# EAGLE schematic PediPeriMeridian (EAGLE 7.1.0)
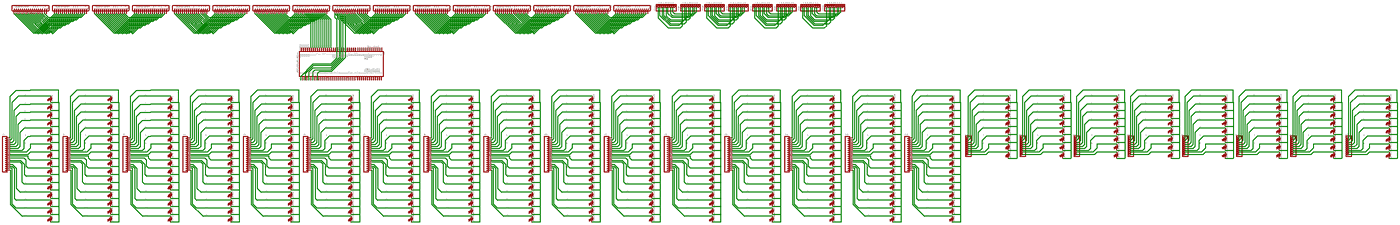
[diagram p0: schematic, sheet 1, overview]
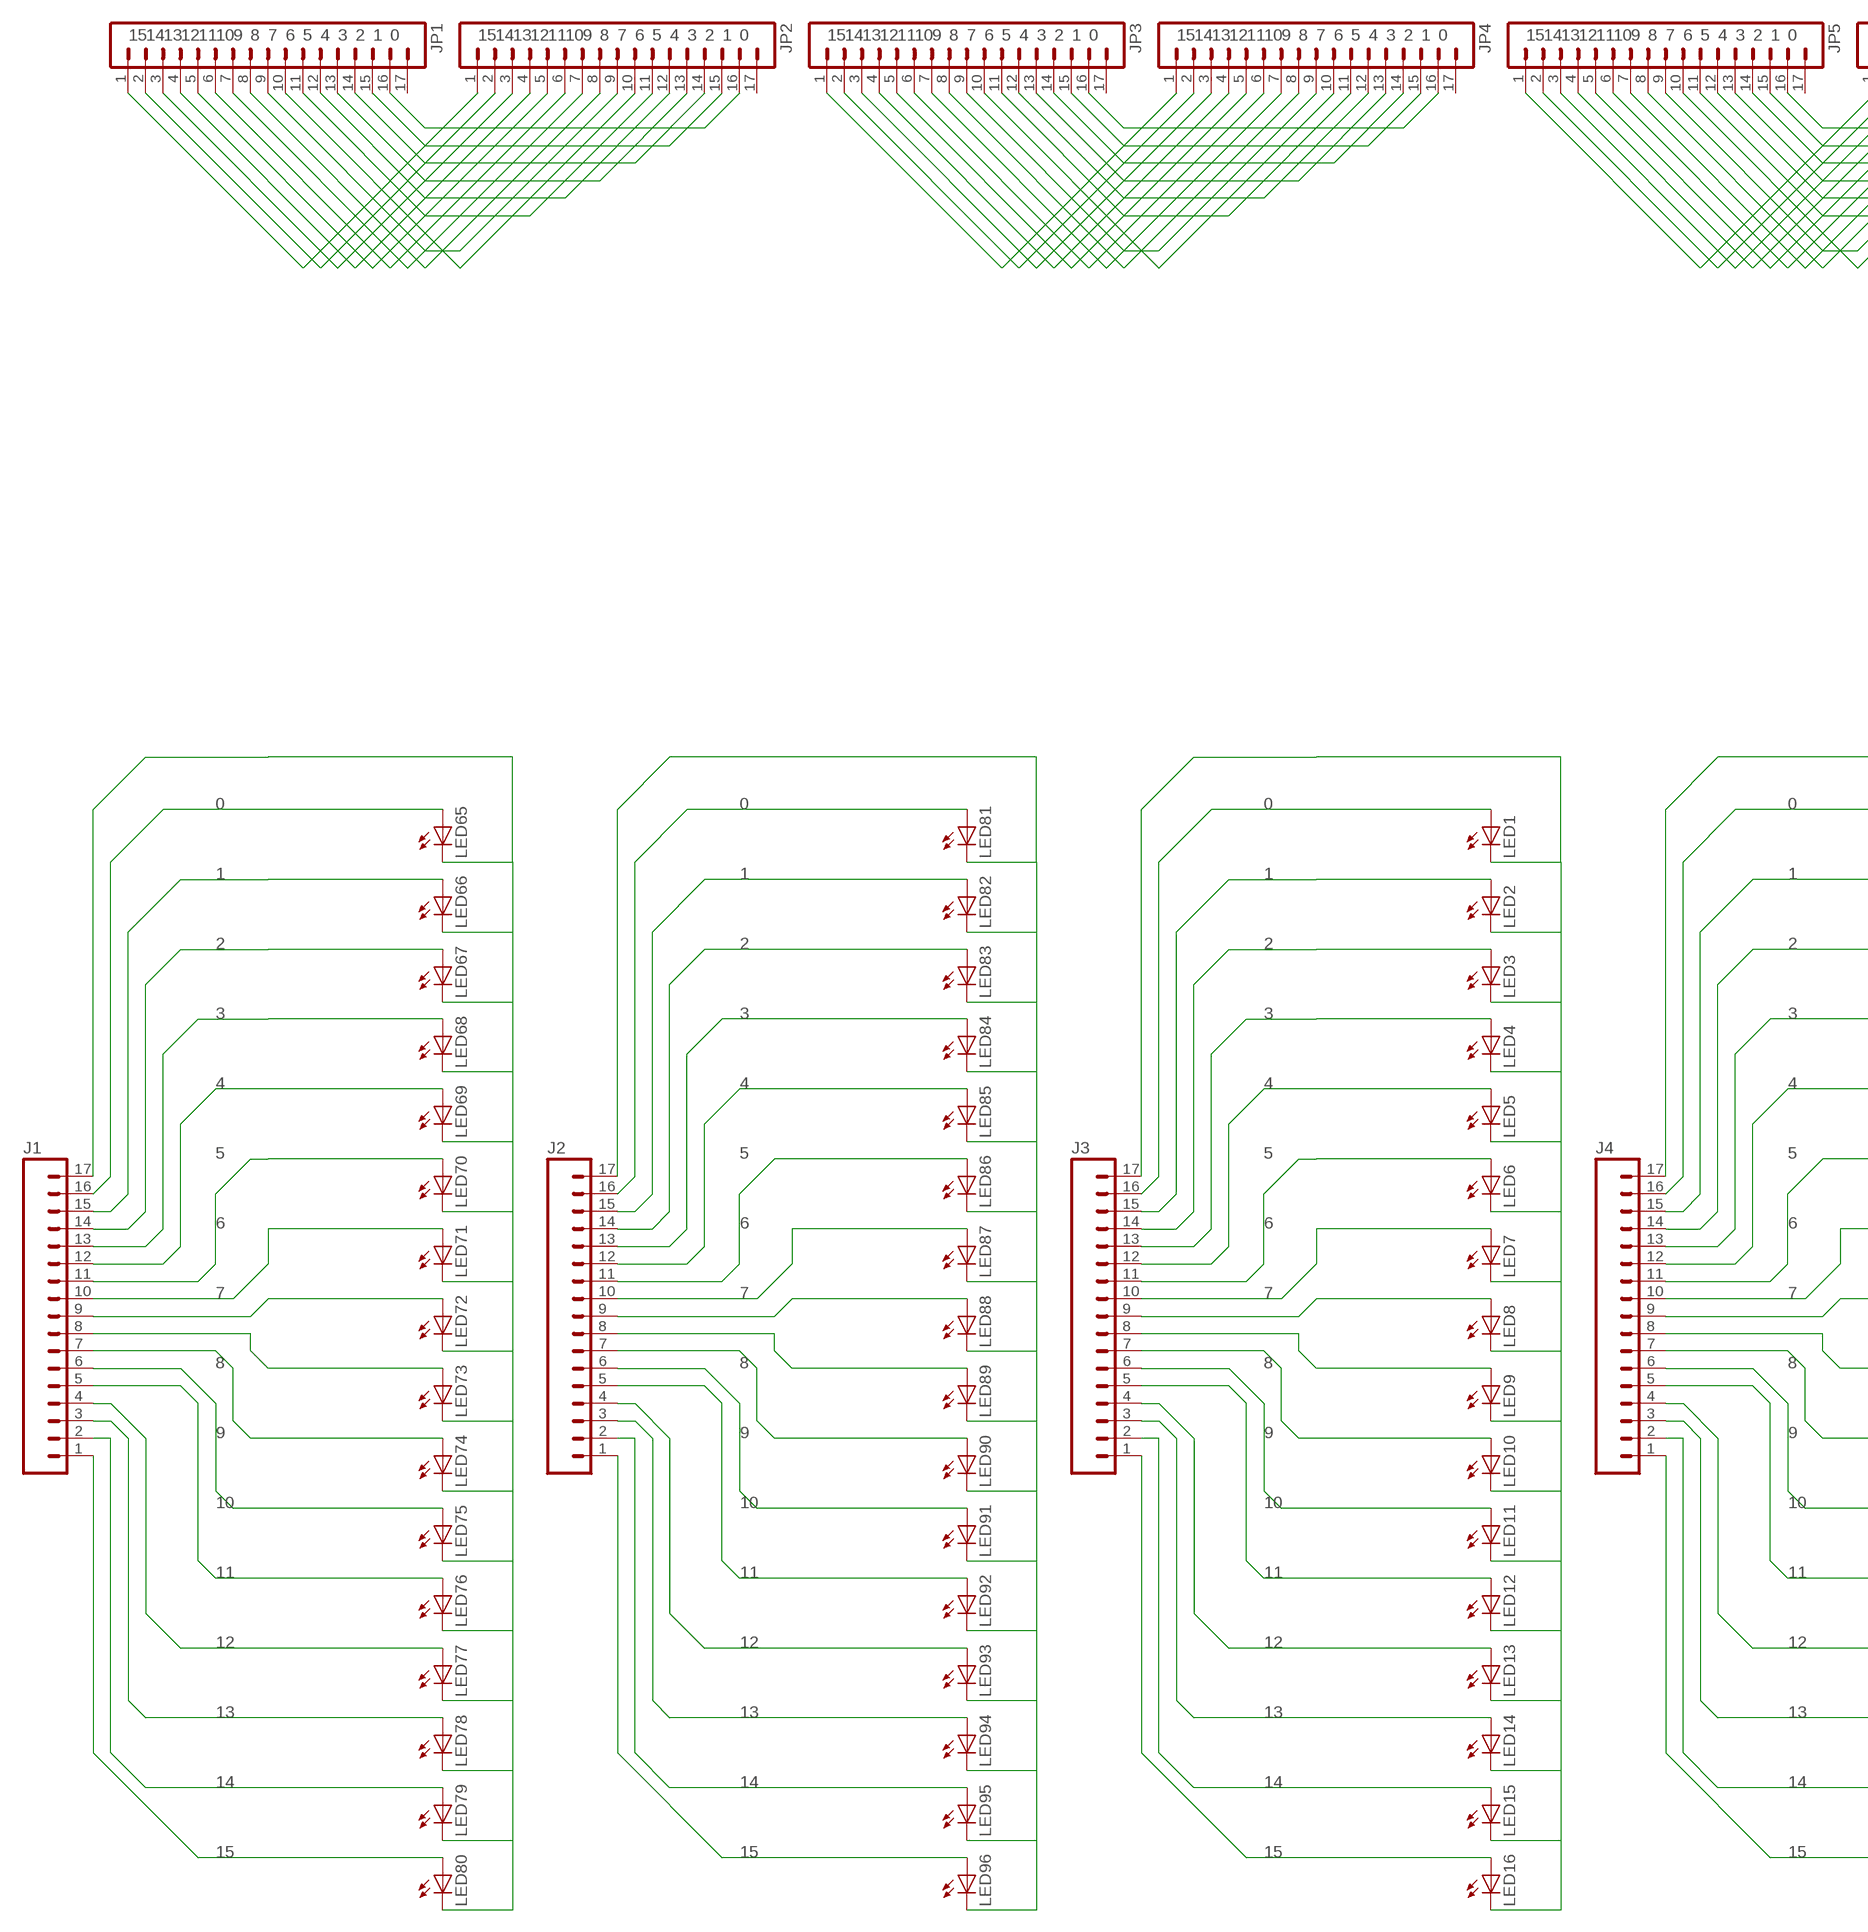
[diagram p1: schematic, sheet 1, part 1 of 5]
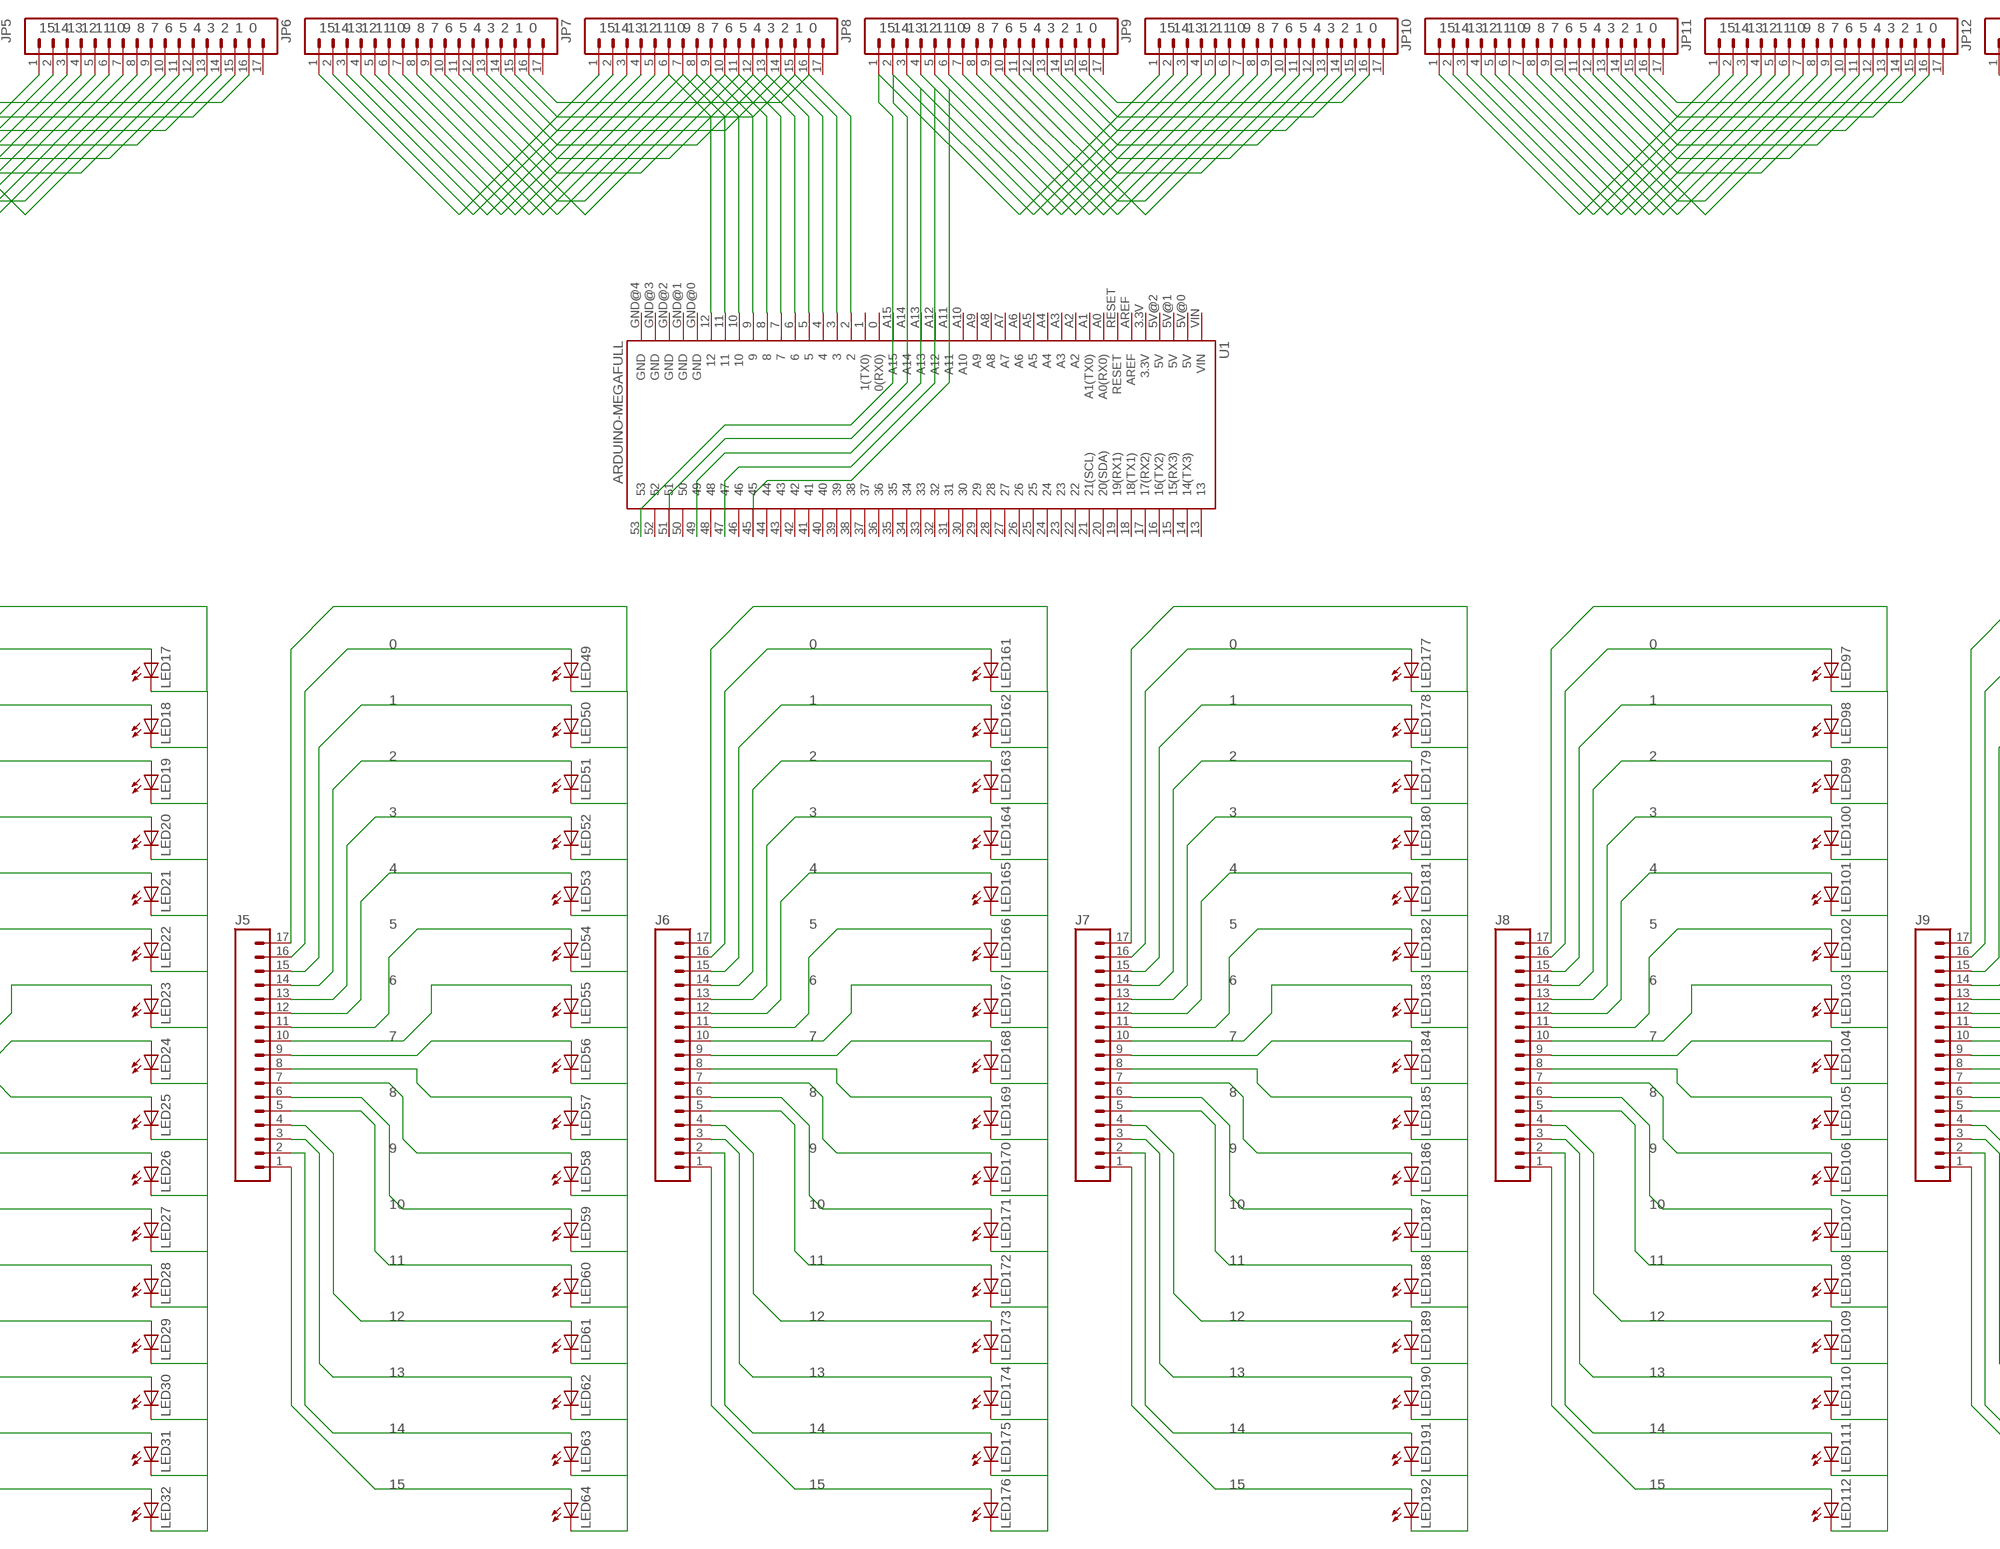
[diagram p2: schematic, sheet 1, part 2 of 5]
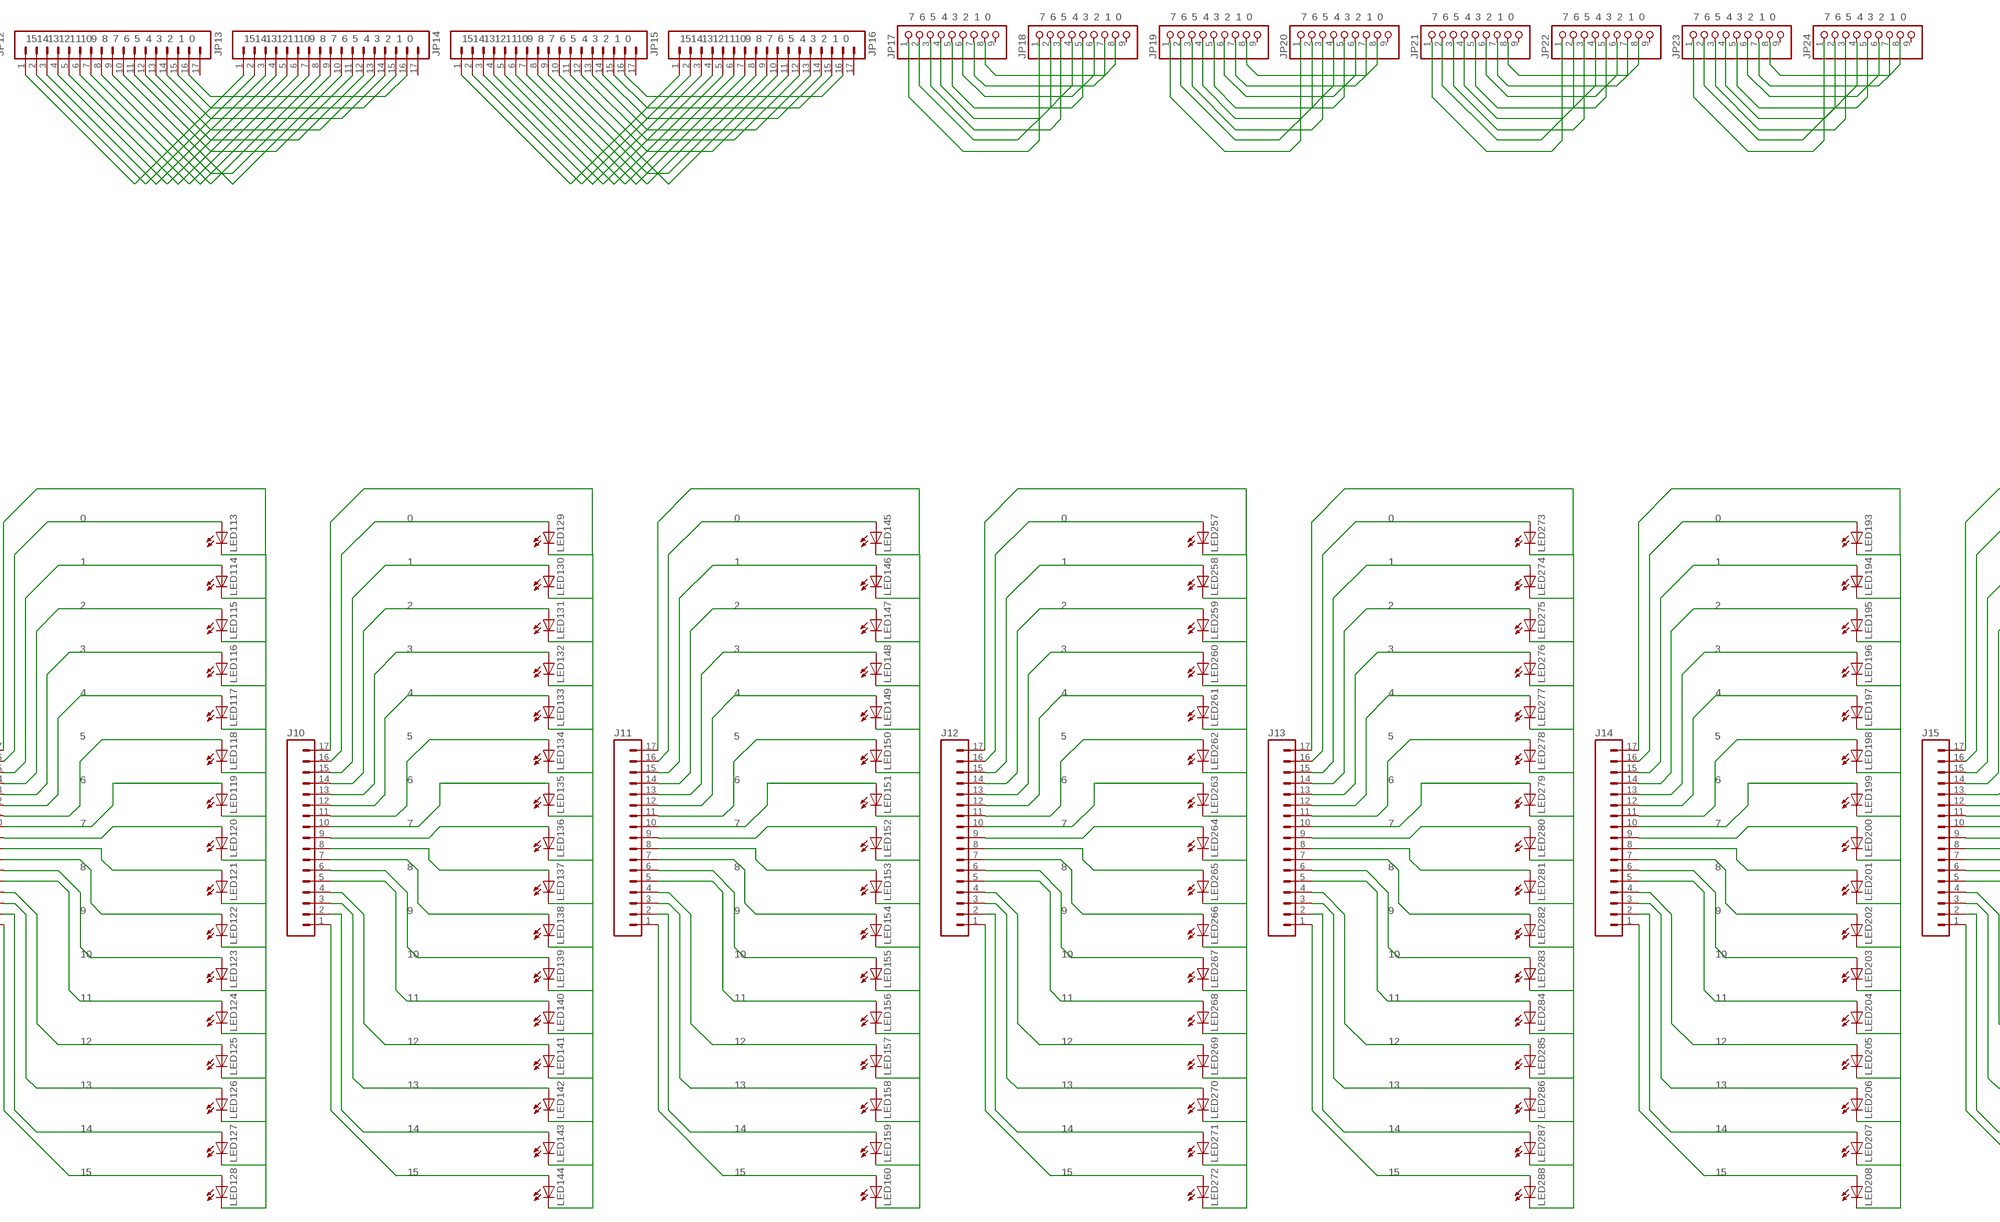
[diagram p3: schematic, sheet 1, part 3 of 5]
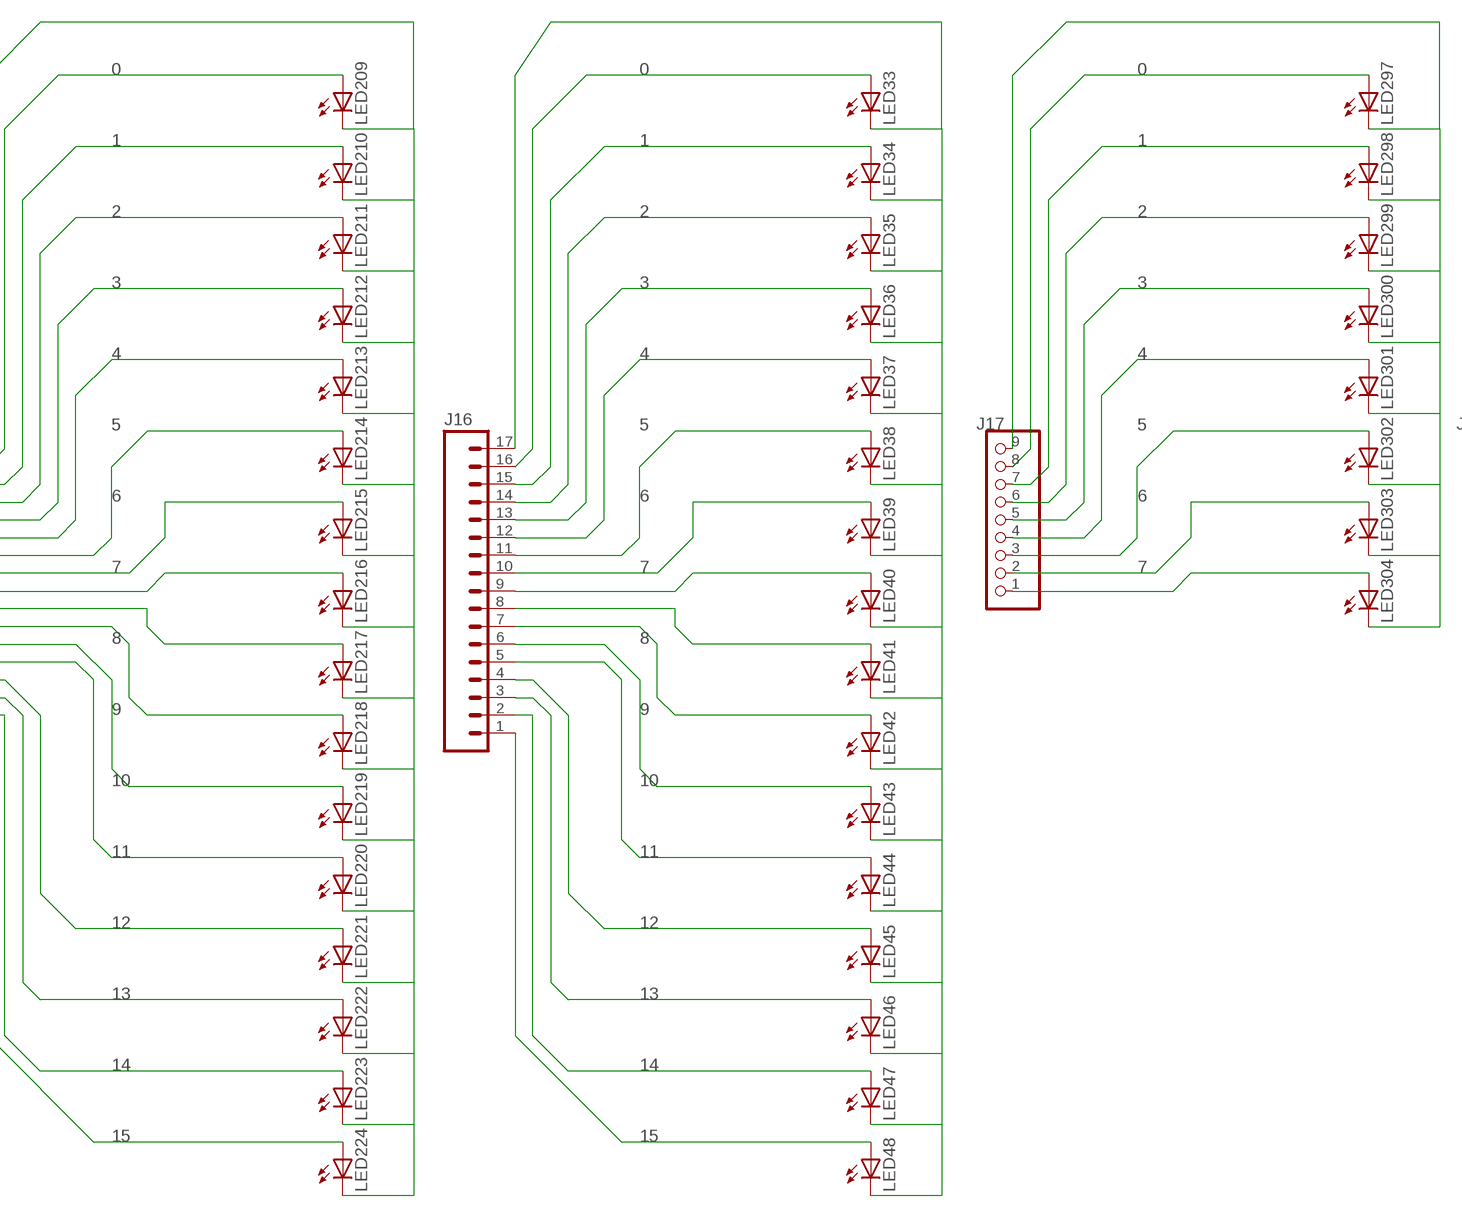
[diagram p4: schematic, sheet 1, part 4 of 5]
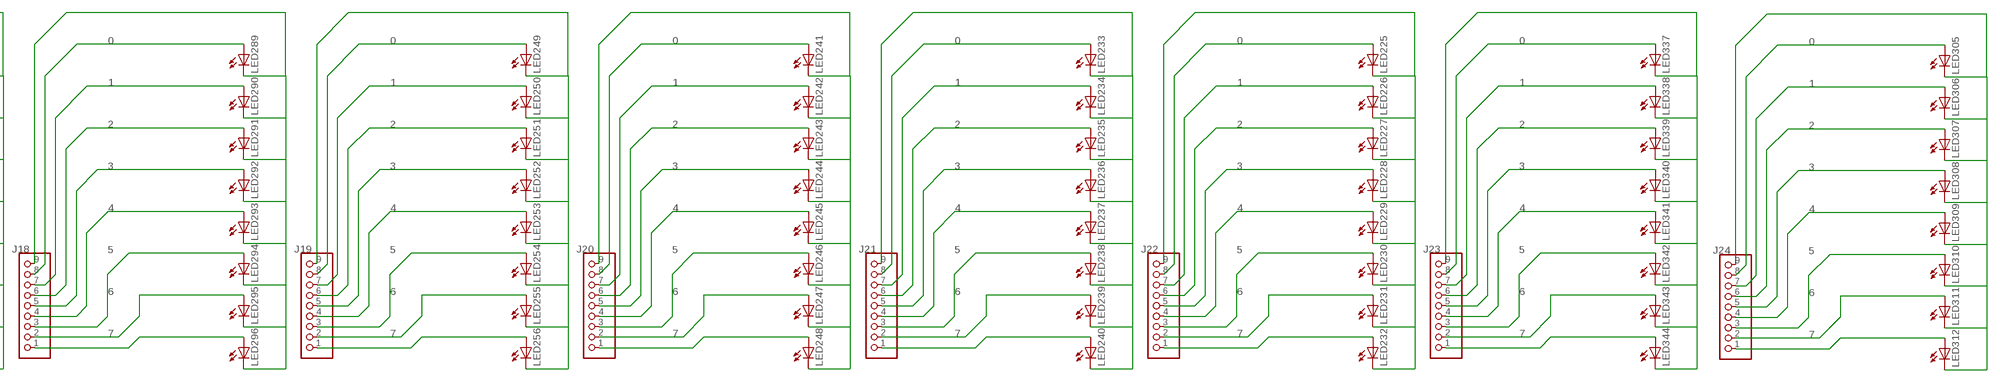
[diagram p5: schematic, sheet 1, part 5 of 5]

## Parts
J1  M17  [1X17]
J2  M17  [1X17]
J3  M17  [1X17]
J4  M17  [1X17]
J5  M17  [1X17]
J6  M17  [1X17]
J7  M17  [1X17]
J8  M17  [1X17]
J9  M17  [1X17]
J10  M17  [1X17]
J11  M17  [1X17]
J12  M17  [1X17]
J13  M17  [1X17]
J14  M17  [1X17]
J15  M17  [1X17]
J16  M17  [1X17]
J17  PINHD-1X9  [1X09-BIG]
J18  PINHD-1X9  [1X09-BIG]
J19  PINHD-1X9  [1X09-BIG]
J20  PINHD-1X9  [1X09-BIG]
J21  PINHD-1X9  [1X09-BIG]
J22  PINHD-1X9  [1X09-BIG]
J23  PINHD-1X9  [1X09-BIG]
J24  PINHD-1X9  [1X09-BIG]
JP1  M17  [1X17]
JP2  M17  [1X17]
JP3  M17  [1X17]
JP4  M17  [1X17]
JP5  M17  [1X17]
JP6  M17  [1X17]
JP7  M17  [1X17]
JP8  M17  [1X17]
JP9  M17  [1X17]
JP10  M17  [1X17]
JP11  M17  [1X17]
JP12  M17  [1X17]
JP13  M17  [1X17]
JP14  M17  [1X17]
JP15  M17  [1X17]
JP16  M17  [1X17]
JP17  PINHD-1X9  [1X09-BIG]
JP18  PINHD-1X9  [1X09-BIG]
JP19  PINHD-1X9  [1X09-BIG]
JP20  PINHD-1X9  [1X09-BIG]
JP21  PINHD-1X9  [1X09-BIG]
JP22  PINHD-1X9  [1X09-BIG]
JP23  PINHD-1X9  [1X09-BIG]
JP24  PINHD-1X9  [1X09-BIG]
LED1  LED5MM  [LED5MM]
LED2  LED5MM  [LED5MM]
LED3  LED5MM  [LED5MM]
LED4  LED5MM  [LED5MM]
LED5  LED5MM  [LED5MM]
LED6  LED5MM  [LED5MM]
LED7  LED5MM  [LED5MM]
LED8  LED5MM  [LED5MM]
LED9  LED5MM  [LED5MM]
LED10  LED5MM  [LED5MM]
LED11  LED5MM  [LED5MM]
LED12  LED5MM  [LED5MM]
LED13  LED5MM  [LED5MM]
LED14  LED5MM  [LED5MM]
LED15  LED5MM  [LED5MM]
LED16  LED5MM  [LED5MM]
LED17  LED5MM  [LED5MM]
LED18  LED5MM  [LED5MM]
LED19  LED5MM  [LED5MM]
LED20  LED5MM  [LED5MM]
LED21  LED5MM  [LED5MM]
LED22  LED5MM  [LED5MM]
LED23  LED5MM  [LED5MM]
LED24  LED5MM  [LED5MM]
LED25  LED5MM  [LED5MM]
LED26  LED5MM  [LED5MM]
LED27  LED5MM  [LED5MM]
LED28  LED5MM  [LED5MM]
LED29  LED5MM  [LED5MM]
LED30  LED5MM  [LED5MM]
LED31  LED5MM  [LED5MM]
LED32  LED5MM  [LED5MM]
LED33  LED5MM  [LED5MM]
LED34  LED5MM  [LED5MM]
LED35  LED5MM  [LED5MM]
LED36  LED5MM  [LED5MM]
LED37  LED5MM  [LED5MM]
LED38  LED5MM  [LED5MM]
LED39  LED5MM  [LED5MM]
LED40  LED5MM  [LED5MM]
LED41  LED5MM  [LED5MM]
LED42  LED5MM  [LED5MM]
LED43  LED5MM  [LED5MM]
LED44  LED5MM  [LED5MM]
LED45  LED5MM  [LED5MM]
LED46  LED5MM  [LED5MM]
LED47  LED5MM  [LED5MM]
LED48  LED5MM  [LED5MM]
LED49  LED5MM  [LED5MM]
LED50  LED5MM  [LED5MM]
LED51  LED5MM  [LED5MM]
LED52  LED5MM  [LED5MM]
LED53  LED5MM  [LED5MM]
LED54  LED5MM  [LED5MM]
LED55  LED5MM  [LED5MM]
LED56  LED5MM  [LED5MM]
LED57  LED5MM  [LED5MM]
LED58  LED5MM  [LED5MM]
LED59  LED5MM  [LED5MM]
LED60  LED5MM  [LED5MM]
LED61  LED5MM  [LED5MM]
LED62  LED5MM  [LED5MM]
LED63  LED5MM  [LED5MM]
LED64  LED5MM  [LED5MM]
LED65  LED5MM  [LED5MM]
LED66  LED5MM  [LED5MM]
LED67  LED5MM  [LED5MM]
LED68  LED5MM  [LED5MM]
LED69  LED5MM  [LED5MM]
LED70  LED5MM  [LED5MM]
LED71  LED5MM  [LED5MM]
LED72  LED5MM  [LED5MM]
LED73  LED5MM  [LED5MM]
LED74  LED5MM  [LED5MM]
LED75  LED5MM  [LED5MM]
LED76  LED5MM  [LED5MM]
LED77  LED5MM  [LED5MM]
LED78  LED5MM  [LED5MM]
LED79  LED5MM  [LED5MM]
LED80  LED5MM  [LED5MM]
LED81  LED5MM  [LED5MM]
LED82  LED5MM  [LED5MM]
LED83  LED5MM  [LED5MM]
LED84  LED5MM  [LED5MM]
LED85  LED5MM  [LED5MM]
LED86  LED5MM  [LED5MM]
LED87  LED5MM  [LED5MM]
LED88  LED5MM  [LED5MM]
LED89  LED5MM  [LED5MM]
LED90  LED5MM  [LED5MM]
LED91  LED5MM  [LED5MM]
LED92  LED5MM  [LED5MM]
LED93  LED5MM  [LED5MM]
LED94  LED5MM  [LED5MM]
LED95  LED5MM  [LED5MM]
LED96  LED5MM  [LED5MM]
LED97  LED5MM  [LED5MM]
LED98  LED5MM  [LED5MM]
LED99  LED5MM  [LED5MM]
LED100  LED5MM  [LED5MM]
LED101  LED5MM  [LED5MM]
LED102  LED5MM  [LED5MM]
LED103  LED5MM  [LED5MM]
LED104  LED5MM  [LED5MM]
LED105  LED5MM  [LED5MM]
LED106  LED5MM  [LED5MM]
LED107  LED5MM  [LED5MM]
LED108  LED5MM  [LED5MM]
LED109  LED5MM  [LED5MM]
LED110  LED5MM  [LED5MM]
LED111  LED5MM  [LED5MM]
LED112  LED5MM  [LED5MM]
LED113  LED5MM  [LED5MM]
LED114  LED5MM  [LED5MM]
LED115  LED5MM  [LED5MM]
LED116  LED5MM  [LED5MM]
LED117  LED5MM  [LED5MM]
LED118  LED5MM  [LED5MM]
LED119  LED5MM  [LED5MM]
LED120  LED5MM  [LED5MM]
LED121  LED5MM  [LED5MM]
LED122  LED5MM  [LED5MM]
LED123  LED5MM  [LED5MM]
LED124  LED5MM  [LED5MM]
LED125  LED5MM  [LED5MM]
LED126  LED5MM  [LED5MM]
LED127  LED5MM  [LED5MM]
LED128  LED5MM  [LED5MM]
LED129  LED5MM  [LED5MM]
LED130  LED5MM  [LED5MM]
LED131  LED5MM  [LED5MM]
LED132  LED5MM  [LED5MM]
LED133  LED5MM  [LED5MM]
LED134  LED5MM  [LED5MM]
LED135  LED5MM  [LED5MM]
LED136  LED5MM  [LED5MM]
LED137  LED5MM  [LED5MM]
LED138  LED5MM  [LED5MM]
LED139  LED5MM  [LED5MM]
LED140  LED5MM  [LED5MM]
LED141  LED5MM  [LED5MM]
LED142  LED5MM  [LED5MM]
LED143  LED5MM  [LED5MM]
LED144  LED5MM  [LED5MM]
LED145  LED5MM  [LED5MM]
LED146  LED5MM  [LED5MM]
LED147  LED5MM  [LED5MM]
LED148  LED5MM  [LED5MM]
LED149  LED5MM  [LED5MM]
LED150  LED5MM  [LED5MM]
LED151  LED5MM  [LED5MM]
LED152  LED5MM  [LED5MM]
LED153  LED5MM  [LED5MM]
LED154  LED5MM  [LED5MM]
LED155  LED5MM  [LED5MM]
LED156  LED5MM  [LED5MM]
LED157  LED5MM  [LED5MM]
LED158  LED5MM  [LED5MM]
LED159  LED5MM  [LED5MM]
LED160  LED5MM  [LED5MM]
LED161  LED5MM  [LED5MM]
LED162  LED5MM  [LED5MM]
LED163  LED5MM  [LED5MM]
LED164  LED5MM  [LED5MM]
LED165  LED5MM  [LED5MM]
LED166  LED5MM  [LED5MM]
LED167  LED5MM  [LED5MM]
LED168  LED5MM  [LED5MM]
LED169  LED5MM  [LED5MM]
LED170  LED5MM  [LED5MM]
LED171  LED5MM  [LED5MM]
LED172  LED5MM  [LED5MM]
LED173  LED5MM  [LED5MM]
LED174  LED5MM  [LED5MM]
LED175  LED5MM  [LED5MM]
LED176  LED5MM  [LED5MM]
LED177  LED5MM  [LED5MM]
LED178  LED5MM  [LED5MM]
LED179  LED5MM  [LED5MM]
LED180  LED5MM  [LED5MM]
LED181  LED5MM  [LED5MM]
LED182  LED5MM  [LED5MM]
LED183  LED5MM  [LED5MM]
LED184  LED5MM  [LED5MM]
LED185  LED5MM  [LED5MM]
LED186  LED5MM  [LED5MM]
LED187  LED5MM  [LED5MM]
LED188  LED5MM  [LED5MM]
LED189  LED5MM  [LED5MM]
LED190  LED5MM  [LED5MM]
LED191  LED5MM  [LED5MM]
LED192  LED5MM  [LED5MM]
LED193  LED5MM  [LED5MM]
LED194  LED5MM  [LED5MM]
LED195  LED5MM  [LED5MM]
LED196  LED5MM  [LED5MM]
LED197  LED5MM  [LED5MM]
LED198  LED5MM  [LED5MM]
LED199  LED5MM  [LED5MM]
LED200  LED5MM  [LED5MM]
LED201  LED5MM  [LED5MM]
LED202  LED5MM  [LED5MM]
LED203  LED5MM  [LED5MM]
LED204  LED5MM  [LED5MM]
LED205  LED5MM  [LED5MM]
LED206  LED5MM  [LED5MM]
LED207  LED5MM  [LED5MM]
LED208  LED5MM  [LED5MM]
LED209  LED5MM  [LED5MM]
LED210  LED5MM  [LED5MM]
LED211  LED5MM  [LED5MM]
LED212  LED5MM  [LED5MM]
LED213  LED5MM  [LED5MM]
LED214  LED5MM  [LED5MM]
LED215  LED5MM  [LED5MM]
LED216  LED5MM  [LED5MM]
LED217  LED5MM  [LED5MM]
LED218  LED5MM  [LED5MM]
LED219  LED5MM  [LED5MM]
LED220  LED5MM  [LED5MM]
LED221  LED5MM  [LED5MM]
LED222  LED5MM  [LED5MM]
LED223  LED5MM  [LED5MM]
LED224  LED5MM  [LED5MM]
LED225  LED5MM  [LED5MM]
LED226  LED5MM  [LED5MM]
LED227  LED5MM  [LED5MM]
LED228  LED5MM  [LED5MM]
LED229  LED5MM  [LED5MM]
LED230  LED5MM  [LED5MM]
LED231  LED5MM  [LED5MM]
LED232  LED5MM  [LED5MM]
LED233  LED5MM  [LED5MM]
LED234  LED5MM  [LED5MM]
LED235  LED5MM  [LED5MM]
LED236  LED5MM  [LED5MM]
LED237  LED5MM  [LED5MM]
LED238  LED5MM  [LED5MM]
LED239  LED5MM  [LED5MM]
LED240  LED5MM  [LED5MM]
LED241  LED5MM  [LED5MM]
LED242  LED5MM  [LED5MM]
LED243  LED5MM  [LED5MM]
LED244  LED5MM  [LED5MM]
LED245  LED5MM  [LED5MM]
LED246  LED5MM  [LED5MM]
LED247  LED5MM  [LED5MM]
LED248  LED5MM  [LED5MM]
LED249  LED5MM  [LED5MM]
LED250  LED5MM  [LED5MM]
LED251  LED5MM  [LED5MM]
LED252  LED5MM  [LED5MM]
LED253  LED5MM  [LED5MM]
LED254  LED5MM  [LED5MM]
LED255  LED5MM  [LED5MM]
LED256  LED5MM  [LED5MM]
LED257  LED5MM  [LED5MM]
LED258  LED5MM  [LED5MM]
LED259  LED5MM  [LED5MM]
LED260  LED5MM  [LED5MM]
LED261  LED5MM  [LED5MM]
LED262  LED5MM  [LED5MM]
LED263  LED5MM  [LED5MM]
LED264  LED5MM  [LED5MM]
LED265  LED5MM  [LED5MM]
LED266  LED5MM  [LED5MM]
LED267  LED5MM  [LED5MM]
LED268  LED5MM  [LED5MM]
LED269  LED5MM  [LED5MM]
LED270  LED5MM  [LED5MM]
LED271  LED5MM  [LED5MM]
LED272  LED5MM  [LED5MM]
LED273  LED5MM  [LED5MM]
LED274  LED5MM  [LED5MM]
LED275  LED5MM  [LED5MM]
LED276  LED5MM  [LED5MM]
LED277  LED5MM  [LED5MM]
LED278  LED5MM  [LED5MM]
LED279  LED5MM  [LED5MM]
LED280  LED5MM  [LED5MM]
LED281  LED5MM  [LED5MM]
LED282  LED5MM  [LED5MM]
LED283  LED5MM  [LED5MM]
LED284  LED5MM  [LED5MM]
LED285  LED5MM  [LED5MM]
LED286  LED5MM  [LED5MM]
LED287  LED5MM  [LED5MM]
LED288  LED5MM  [LED5MM]
LED289  LED5MM  [LED5MM]
LED290  LED5MM  [LED5MM]
LED291  LED5MM  [LED5MM]
LED292  LED5MM  [LED5MM]
LED293  LED5MM  [LED5MM]
LED294  LED5MM  [LED5MM]
LED295  LED5MM  [LED5MM]
LED296  LED5MM  [LED5MM]
LED297  LED5MM  [LED5MM]
LED298  LED5MM  [LED5MM]
LED299  LED5MM  [LED5MM]
LED300  LED5MM  [LED5MM]
LED301  LED5MM  [LED5MM]
LED302  LED5MM  [LED5MM]
LED303  LED5MM  [LED5MM]
LED304  LED5MM  [LED5MM]
LED305  LED5MM  [LED5MM]
LED306  LED5MM  [LED5MM]
LED307  LED5MM  [LED5MM]
LED308  LED5MM  [LED5MM]
LED309  LED5MM  [LED5MM]
LED310  LED5MM  [LED5MM]
LED311  LED5MM  [LED5MM]
LED312  LED5MM  [LED5MM]
LED337  LED5MM  [LED5MM]
LED338  LED5MM  [LED5MM]
LED339  LED5MM  [LED5MM]
LED340  LED5MM  [LED5MM]
LED341  LED5MM  [LED5MM]
LED342  LED5MM  [LED5MM]
LED343  LED5MM  [LED5MM]
LED344  LED5MM  [LED5MM]
U1  ARDUINO-MEGAFULL  [ARDUINO_MEGA]

## Nets
0: J1.16 J2.16 J3.16 J4.16 J5.16 J6.16 J7.16 J8.16 J9.16 J10.16 J11.16 J12.16 J13.16 J14.16 J15.16 J16.16 J17.8 J18.8 J19.8 J20.8 J21.8 J22.8 J23.8 J24.8 JP1.16 JP2.16 JP3.16 JP4.16 JP5.16 JP6.16 JP7.16 JP8.16 JP9.16 JP10.16 JP11.16 JP12.16 JP13.16 JP14.16 JP15.16 JP16.16 JP17.8 JP18.8 JP19.8 JP20.8 JP21.8 JP22.8 JP23.8 JP24.8 LED1.A LED17.A LED33.A LED49.A LED65.A LED81.A LED97.A LED113.A LED129.A LED145.A LED161.A LED177.A LED193.A LED209.A LED225.A LED233.A LED241.A LED249.A LED257.A LED273.A LED289.A LED297.A LED305.A LED337.A U1.2
1: J1.15 J2.15 J3.15 J4.15 J5.15 J6.15 J7.15 J8.15 J9.15 J10.15 J11.15 J12.15 J13.15 J14.15 J15.15 J16.15 J17.7 J18.7 J19.7 J20.7 J21.7 J22.7 J23.7 J24.7 JP1.15 JP2.15 JP3.15 JP4.15 JP5.15 JP6.15 JP7.15 JP8.15 JP9.15 JP10.15 JP11.15 JP12.15 JP13.15 JP14.15 JP15.15 JP16.15 JP17.7 JP18.7 JP19.7 JP20.7 JP21.7 JP22.7 JP23.7 JP24.7 LED2.A LED18.A LED34.A LED50.A LED66.A LED82.A LED98.A LED114.A LED130.A LED146.A LED162.A LED178.A LED194.A LED210.A LED226.A LED234.A LED242.A LED250.A LED258.A LED274.A LED290.A LED298.A LED306.A LED338.A U1.3
2: J1.14 J2.14 J3.14 J4.14 J5.14 J6.14 J7.14 J8.14 J9.14 J10.14 J11.14 J12.14 J13.14 J14.14 J15.14 J16.14 J17.6 J18.6 J19.6 J20.6 J21.6 J22.6 J23.6 J24.6 JP1.14 JP2.14 JP3.14 JP4.14 JP5.14 JP6.14 JP7.14 JP8.14 JP9.14 JP10.14 JP11.14 JP12.14 JP13.14 JP14.14 JP15.14 JP16.14 JP17.6 JP18.6 JP19.6 JP20.6 JP21.6 JP22.6 JP23.6 JP24.6 LED3.A LED19.A LED35.A LED51.A LED67.A LED83.A LED99.A LED115.A LED131.A LED147.A LED163.A LED179.A LED195.A LED211.A LED227.A LED235.A LED243.A LED251.A LED259.A LED275.A LED291.A LED299.A LED307.A LED339.A U1.4
3: J1.13 J2.13 J3.13 J4.13 J5.13 J6.13 J7.13 J8.13 J9.13 J10.13 J11.13 J12.13 J13.13 J14.13 J15.13 J16.13 J17.5 J18.5 J19.5 J20.5 J21.5 J22.5 J23.5 J24.5 JP1.13 JP2.13 JP3.13 JP4.13 JP5.13 JP6.13 JP7.13 JP8.13 JP9.13 JP10.13 JP11.13 JP12.13 JP13.13 JP14.13 JP15.13 JP16.13 JP17.5 JP18.5 JP19.5 JP20.5 JP21.5 JP22.5 JP23.5 JP24.5 LED4.A LED20.A LED36.A LED52.A LED68.A LED84.A LED100.A LED116.A LED132.A LED148.A LED164.A LED180.A LED196.A LED212.A LED228.A LED236.A LED244.A LED252.A LED260.A LED276.A LED292.A LED300.A LED308.A LED340.A U1.5
4: J1.12 J2.12 J3.12 J4.12 J5.12 J6.12 J7.12 J8.12 J9.12 J10.12 J11.12 J12.12 J13.12 J14.12 J15.12 J16.12 J17.4 J18.4 J19.4 J20.4 J21.4 J22.4 J23.4 J24.4 JP1.12 JP2.12 JP3.12 JP4.12 JP5.12 JP6.12 JP7.12 JP8.12 JP9.12 JP10.12 JP11.12 JP12.12 JP13.12 JP14.12 JP15.12 JP16.12 JP17.4 JP18.4 JP19.4 JP20.4 JP21.4 JP22.4 JP23.4 JP24.4 LED5.A LED21.A LED37.A LED53.A LED69.A LED85.A LED101.A LED117.A LED133.A LED149.A LED165.A LED181.A LED197.A LED213.A LED229.A LED237.A LED245.A LED253.A LED261.A LED277.A LED293.A LED301.A LED309.A LED341.A U1.6
5: J1.11 J2.11 J3.11 J4.11 J5.11 J6.11 J7.11 J8.11 J9.11 J10.11 J11.11 J12.11 J13.11 J14.11 J15.11 J16.11 J17.3 J18.3 J19.3 J20.3 J21.3 J22.3 J23.3 J24.3 JP1.11 JP2.11 JP3.11 JP4.11 JP5.11 JP6.11 JP7.11 JP8.11 JP9.11 JP10.11 JP11.11 JP12.11 JP13.11 JP14.11 JP15.11 JP16.11 JP17.3 JP18.3 JP19.3 JP20.3 JP21.3 JP22.3 JP23.3 JP24.3 LED6.A LED22.A LED38.A LED54.A LED70.A LED86.A LED102.A LED118.A LED134.A LED150.A LED166.A LED182.A LED198.A LED214.A LED230.A LED238.A LED246.A LED254.A LED262.A LED278.A LED294.A LED302.A LED310.A LED342.A U1.7
6: J1.10 J2.10 J3.10 J4.10 J5.10 J6.10 J7.10 J8.10 J9.10 J10.10 J11.10 J12.10 J13.10 J14.10 J15.10 J16.10 J17.2 J18.2 J19.2 J20.2 J21.2 J22.2 J23.2 J24.2 JP1.10 JP2.10 JP3.10 JP4.10 JP5.10 JP6.10 JP7.10 JP8.10 JP9.10 JP10.10 JP11.10 JP12.10 JP13.10 JP14.10 JP15.10 JP16.10 JP17.2 JP18.2 JP19.2 JP20.2 JP21.2 JP22.2 JP23.2 JP24.2 LED7.A LED23.A LED39.A LED55.A LED71.A LED87.A LED103.A LED119.A LED135.A LED151.A LED167.A LED183.A LED199.A LED215.A LED231.A LED239.A LED247.A LED255.A LED263.A LED279.A LED295.A LED303.A LED311.A LED343.A U1.8
7: J1.9 J2.9 J3.9 J4.9 J5.9 J6.9 J7.9 J8.9 J9.9 J10.9 J11.9 J12.9 J13.9 J14.9 J15.9 J16.9 J17.1 J18.1 J19.1 J20.1 J21.1 J22.1 J23.1 J24.1 JP1.9 JP2.9 JP3.9 JP4.9 JP5.9 JP6.9 JP7.9 JP8.9 JP9.9 JP10.9 JP11.9 JP12.9 JP13.9 JP14.9 JP15.9 JP16.9 JP17.1 JP18.1 JP19.1 JP20.1 JP21.1 JP22.1 JP23.1 JP24.1 LED8.A LED24.A LED40.A LED56.A LED72.A LED88.A LED104.A LED120.A LED136.A LED152.A LED168.A LED184.A LED200.A LED216.A LED232.A LED240.A LED248.A LED256.A LED264.A LED280.A LED296.A LED304.A LED312.A LED344.A U1.9
8: J1.8 J2.8 J3.8 J4.8 J5.8 J6.8 J7.8 J8.8 J9.8 J10.8 J11.8 J12.8 J13.8 J14.8 J15.8 J16.8 JP1.8 JP2.8 JP3.8 JP4.8 JP5.8 JP6.8 JP7.8 JP8.8 JP9.8 JP10.8 JP11.8 JP12.8 JP13.8 JP14.8 JP15.8 JP16.8 LED9.A LED25.A LED41.A LED57.A LED73.A LED89.A LED105.A LED121.A LED137.A LED153.A LED169.A LED185.A LED201.A LED217.A LED265.A LED281.A U1.10
9: J1.7 J2.7 J3.7 J4.7 J5.7 J6.7 J7.7 J8.7 J9.7 J10.7 J11.7 J12.7 J13.7 J14.7 J15.7 J16.7 JP1.7 JP2.7 JP3.7 JP4.7 JP5.7 JP6.7 JP7.7 JP8.7 JP9.7 JP10.7 JP11.7 JP12.7 JP13.7 JP14.7 JP15.7 JP16.7 LED10.A LED26.A LED42.A LED58.A LED74.A LED90.A LED106.A LED122.A LED138.A LED154.A LED170.A LED186.A LED202.A LED218.A LED266.A LED282.A U1.11
10: J1.6 J2.6 J3.6 J4.6 J5.6 J6.6 J7.6 J8.6 J9.6 J10.6 J11.6 J12.6 J13.6 J14.6 J15.6 J16.6 JP1.6 JP2.6 JP3.6 JP4.6 JP5.6 JP6.6 JP7.6 JP8.6 JP9.6 JP10.6 JP11.6 JP12.6 JP13.6 JP14.6 JP15.6 JP16.6 LED11.A LED27.A LED43.A LED59.A LED75.A LED91.A LED107.A LED123.A LED139.A LED155.A LED171.A LED187.A LED203.A LED219.A LED267.A LED283.A U1.12
11: J1.5 J2.5 J3.5 J4.5 J5.5 J6.5 J7.5 J8.5 J9.5 J10.5 J11.5 J12.5 J13.5 J14.5 J15.5 J16.5 JP1.5 JP2.5 JP3.5 JP4.5 JP5.5 JP6.5 JP7.5 JP8.5 JP9.5 JP10.5 JP11.5 JP12.5 JP13.5 JP14.5 JP15.5 JP16.5 LED12.A LED28.A LED44.A LED60.A LED76.A LED92.A LED108.A LED124.A LED140.A LED156.A LED172.A LED188.A LED204.A LED220.A LED268.A LED284.A U1.45
12: J1.4 J2.4 J3.4 J4.4 J5.4 J6.4 J7.4 J8.4 J9.4 J10.4 J11.4 J12.4 J13.4 J14.4 J15.4 J16.4 JP1.4 JP2.4 JP3.4 JP4.4 JP5.4 JP6.4 JP7.4 JP8.4 JP9.4 JP10.4 JP11.4 JP12.4 JP13.4 JP14.4 JP15.4 JP16.4 LED13.A LED29.A LED45.A LED61.A LED77.A LED93.A LED109.A LED125.A LED141.A LED157.A LED173.A LED189.A LED205.A LED221.A LED269.A LED285.A U1.47
13: J1.3 J2.3 J3.3 J4.3 J5.3 J6.3 J7.3 J8.3 J9.3 J10.3 J11.3 J12.3 J13.3 J14.3 J15.3 J16.3 JP1.3 JP2.3 JP3.3 JP4.3 JP5.3 JP6.3 JP7.3 JP8.3 JP9.3 JP10.3 JP11.3 JP12.3 JP13.3 JP14.3 JP15.3 JP16.3 LED14.A LED30.A LED46.A LED62.A LED78.A LED94.A LED110.A LED126.A LED142.A LED158.A LED174.A LED190.A LED206.A LED222.A LED270.A LED286.A U1.49
14: J1.2 J2.2 J3.2 J4.2 J5.2 J6.2 J7.2 J8.2 J9.2 J10.2 J11.2 J12.2 J13.2 J14.2 J15.2 J16.2 JP1.2 JP2.2 JP3.2 JP4.2 JP5.2 JP6.2 JP7.2 JP8.2 JP9.2 JP10.2 JP11.2 JP12.2 JP13.2 JP14.2 JP15.2 JP16.2 LED15.A LED31.A LED47.A LED63.A LED79.A LED95.A LED111.A LED127.A LED143.A LED159.A LED175.A LED191.A LED207.A LED223.A LED271.A LED287.A U1.51
15: J1.1 J2.1 J3.1 J4.1 J5.1 J6.1 J7.1 J8.1 J9.1 J10.1 J11.1 J12.1 J13.1 J14.1 J15.1 J16.1 JP1.1 JP2.1 JP3.1 JP4.1 JP5.1 JP6.1 JP7.1 JP8.1 JP9.1 JP10.1 JP11.1 JP12.1 JP13.1 JP14.1 JP15.1 JP16.1 LED16.A LED32.A LED48.A LED64.A LED80.A LED96.A LED112.A LED128.A LED144.A LED160.A LED176.A LED192.A LED208.A LED224.A LED272.A LED288.A U1.53
.: J9.17 LED113.K(C) LED114.K(C) LED115.K(C) LED116.K(C) LED117.K(C) LED118.K(C) LED119.K(C) LED120.K(C) LED121.K(C) LED122.K(C) LED123.K(C) LED124.K(C) LED125.K(C) LED126.K(C) LED127.K(C) LED128.K(C)
A: J1.17 LED65.K(C) LED66.K(C) LED67.K(C) LED68.K(C) LED69.K(C) LED70.K(C) LED71.K(C) LED72.K(C) LED73.K(C) LED74.K(C) LED75.K(C) LED76.K(C) LED77.K(C) LED78.K(C) LED79.K(C) LED80.K(C)
B: J2.17 LED81.K(C) LED82.K(C) LED83.K(C) LED84.K(C) LED85.K(C) LED86.K(C) LED87.K(C) LED88.K(C) LED89.K(C) LED90.K(C) LED91.K(C) LED92.K(C) LED93.K(C) LED94.K(C) LED95.K(C) LED96.K(C)
C: J3.17 LED1.K(C) LED2.K(C) LED3.K(C) LED4.K(C) LED5.K(C) LED6.K(C) LED7.K(C) LED8.K(C) LED9.K(C) LED10.K(C) LED11.K(C) LED12.K(C) LED13.K(C) LED14.K(C) LED15.K(C) LED16.K(C)
D: J4.17 LED17.K(C) LED18.K(C) LED19.K(C) LED20.K(C) LED21.K(C) LED22.K(C) LED23.K(C) LED24.K(C) LED25.K(C) LED26.K(C) LED27.K(C) LED28.K(C) LED29.K(C) LED30.K(C) LED31.K(C) LED32.K(C)
E: J5.17 LED49.K(C) LED50.K(C) LED51.K(C) LED52.K(C) LED53.K(C) LED54.K(C) LED55.K(C) LED56.K(C) LED57.K(C) LED58.K(C) LED59.K(C) LED60.K(C) LED61.K(C) LED62.K(C) LED63.K(C) LED64.K(C)
F: J6.17 LED161.K(C) LED162.K(C) LED163.K(C) LED164.K(C) LED165.K(C) LED166.K(C) LED167.K(C) LED168.K(C) LED169.K(C) LED170.K(C) LED171.K(C) LED172.K(C) LED173.K(C) LED174.K(C) LED175.K(C) LED176.K(C)
G: J7.17 LED177.K(C) LED178.K(C) LED179.K(C) LED180.K(C) LED181.K(C) LED182.K(C) LED183.K(C) LED184.K(C) LED185.K(C) LED186.K(C) LED187.K(C) LED188.K(C) LED189.K(C) LED190.K(C) LED191.K(C) LED192.K(C)
H: J8.17 LED97.K(C) LED98.K(C) LED99.K(C) LED100.K(C) LED101.K(C) LED102.K(C) LED103.K(C) LED104.K(C) LED105.K(C) LED106.K(C) LED107.K(C) LED108.K(C) LED109.K(C) LED110.K(C) LED111.K(C) LED112.K(C)
J: J10.17 LED129.K(C) LED130.K(C) LED131.K(C) LED132.K(C) LED133.K(C) LED134.K(C) LED135.K(C) LED136.K(C) LED137.K(C) LED138.K(C) LED139.K(C) LED140.K(C) LED141.K(C) LED142.K(C) LED143.K(C) LED144.K(C)
K: J11.17 LED145.K(C) LED146.K(C) LED147.K(C) LED148.K(C) LED149.K(C) LED150.K(C) LED151.K(C) LED152.K(C) LED153.K(C) LED154.K(C) LED155.K(C) LED156.K(C) LED157.K(C) LED158.K(C) LED159.K(C) LED160.K(C)
L: J12.17 LED257.K(C) LED258.K(C) LED259.K(C) LED260.K(C) LED261.K(C) LED262.K(C) LED263.K(C) LED264.K(C) LED265.K(C) LED266.K(C) LED267.K(C) LED268.K(C) LED269.K(C) LED270.K(C) LED271.K(C) LED272.K(C)
M: J13.17 LED273.K(C) LED274.K(C) LED275.K(C) LED276.K(C) LED277.K(C) LED278.K(C) LED279.K(C) LED280.K(C) LED281.K(C) LED282.K(C) LED283.K(C) LED284.K(C) LED285.K(C) LED286.K(C) LED287.K(C) LED288.K(C)
N: J14.17 LED193.K(C) LED194.K(C) LED195.K(C) LED196.K(C) LED197.K(C) LED198.K(C) LED199.K(C) LED200.K(C) LED201.K(C) LED202.K(C) LED203.K(C) LED204.K(C) LED205.K(C) LED206.K(C) LED207.K(C) LED208.K(C)
O: J15.17 LED209.K(C) LED210.K(C) LED211.K(C) LED212.K(C) LED213.K(C) LED214.K(C) LED215.K(C) LED216.K(C) LED217.K(C) LED218.K(C) LED219.K(C) LED220.K(C) LED221.K(C) LED222.K(C) LED223.K(C) LED224.K(C)
P: J16.17 LED33.K(C) LED34.K(C) LED35.K(C) LED36.K(C) LED37.K(C) LED38.K(C) LED39.K(C) LED40.K(C) LED41.K(C) LED42.K(C) LED43.K(C) LED44.K(C) LED45.K(C) LED46.K(C) LED47.K(C) LED48.K(C)
Q: J17.9 LED297.K(C) LED298.K(C) LED299.K(C) LED300.K(C) LED301.K(C) LED302.K(C) LED303.K(C) LED304.K(C)
R: J18.9 LED289.K(C) LED290.K(C) LED291.K(C) LED292.K(C) LED293.K(C) LED294.K(C) LED295.K(C) LED296.K(C)
S: J19.9 LED249.K(C) LED250.K(C) LED251.K(C) LED252.K(C) LED253.K(C) LED254.K(C) LED255.K(C) LED256.K(C)
T: J20.9 LED241.K(C) LED242.K(C) LED243.K(C) LED244.K(C) LED245.K(C) LED246.K(C) LED247.K(C) LED248.K(C)
U: J21.9 LED233.K(C) LED234.K(C) LED235.K(C) LED236.K(C) LED237.K(C) LED238.K(C) LED239.K(C) LED240.K(C)
V: J22.9 LED225.K(C) LED226.K(C) LED227.K(C) LED228.K(C) LED229.K(C) LED230.K(C) LED231.K(C) LED232.K(C)
W: J23.9 LED337.K(C) LED338.K(C) LED339.K(C) LED340.K(C) LED341.K(C) LED342.K(C) LED343.K(C) LED344.K(C)
X: J24.9 LED305.K(C) LED306.K(C) LED307.K(C) LED308.K(C) LED309.K(C) LED310.K(C) LED311.K(C) LED312.K(C)
Unconnected: JP1.17 JP2.17 JP3.17 JP4.17 JP5.17 JP6.17 JP7.17 JP8.17 JP9.17 JP10.17 JP11.17 JP12.17 JP13.17 JP14.17 JP15.17 JP16.17 JP17.9 JP18.9 JP19.9 JP20.9 JP21.9 JP22.9 JP23.9 JP24.9 U1.0(0(RX0)) U1.1(1(TX0)) U1.3.3V U1.5V@0(5V) U1.5V@1(5V) U1.5V@2(5V) U1.13 U1.14(14(TX3)) U1.15(15(RX3)) U1.16(16(TX2)) U1.17(17(RX2)) U1.18(18(TX1)) U1.19(19(RX1)) U1.20(20(SDA)) U1.21(21(SCL)) U1.22 U1.23 U1.24 U1.25 U1.26 U1.27 U1.28 U1.29 U1.30 U1.31 U1.32 U1.33 U1.34 U1.35 U1.36 U1.37 U1.38 U1.39 U1.40 U1.41 U1.42 U1.43 U1.44 U1.46 U1.48 U1.50 U1.52 U1.A0(A0(RX0)) U1.A1(A1(TX0)) U1.A2 U1.A3 U1.A4 U1.A5 U1.A6 U1.A7 U1.A8 U1.A9 U1.A10 U1.A11 U1.A12 U1.A13 U1.A14 U1.A15 U1.AREF U1.GND@0(GND) U1.GND@1(GND) U1.GND@2(GND) U1.GND@3(GND) U1.GND@4(GND) U1.RESET U1.VIN

## Library data of the parts
J1-J16 JP1-JP16 = SparkFun-Connectors:M17: 1x17 .1" header
J17-J24 JP17-JP24 = adafruit:PINHD-1X9: Pin header 1x10 0.1" spacing With round pins
LED1-LED312 LED337-LED344 = adafruit:LED: LED OSRAM: - CHIPLED LG R971, LG N971, LY N971, LG Q971, LY Q971, LO R971, LY R971 LH N974, LH R974 LS Q976, LO Q976, LY Q976 LO Q996 - Hyper CHIPLED LW Q18S LB Q993, LB Q99A, LB R99A - SideLED LS A670, LO A670, LY A670, LG A670, LP A670 LB A673, LV A673, LT A673, LW A673 LH A674 LY A675 LS A676, LA A676, LO A676, LY A676, LW A676 LS A679, LY A679, LG A679 - Hyper Micro SIDELED® LS Y876, LA Y876, LO Y876, LY Y876 LT Y87S - SmartLED LW L88C, LW L88S LB L89C, LB L89S, LG L890 LS L89K, LO L89K, LY L89K LS L896, LA L896, LO L896, LY L896 - TOPLED LS T670, LO T670, LY T670, LG T670, LP T670 LSG T670, LSP T670, LSY T670, LOP T670, LYG T670 LG T671, LOG T671, LSG T671 LB T673, LV T673, LT T673, LW T673 LH T674 LS T676, LA T676, LO T676, LY T676, LB T676, LH T676, LSB T676, LW T676 LB T67C, LV T67C, LT T67C, LS T67K, LO T67K, LY T67K, LW E67C LS E67B, LA E67B, LO E67B, LY E67B, LB E67C, LV E67C, LT E67C LW T67C LS T679, LY T679, LG T679 LS T770, LO T770, LY T770, LG T770, LP T770 LB T773, LV T773, LT T773, LW T773 LH T774 LS E675, LA E675, LY E675, LS T675 LS T776, LA T776, LO T776, LY T776, LB T776 LHGB T686 LT T68C, LB T68C - Hyper Mini TOPLED® LB M676 - Mini TOPLED Santana® LG M470 LS M47K, LO M47K, LY M47K Source: http://www.osram.convergy.de/
U1 = SparkFun-Boards:ARDUINO-MEGA: Arduino Mega board footprint